# EAGLE design MOTORSHIELDV3_HETPRO_v2 (EAGLE 6.4)
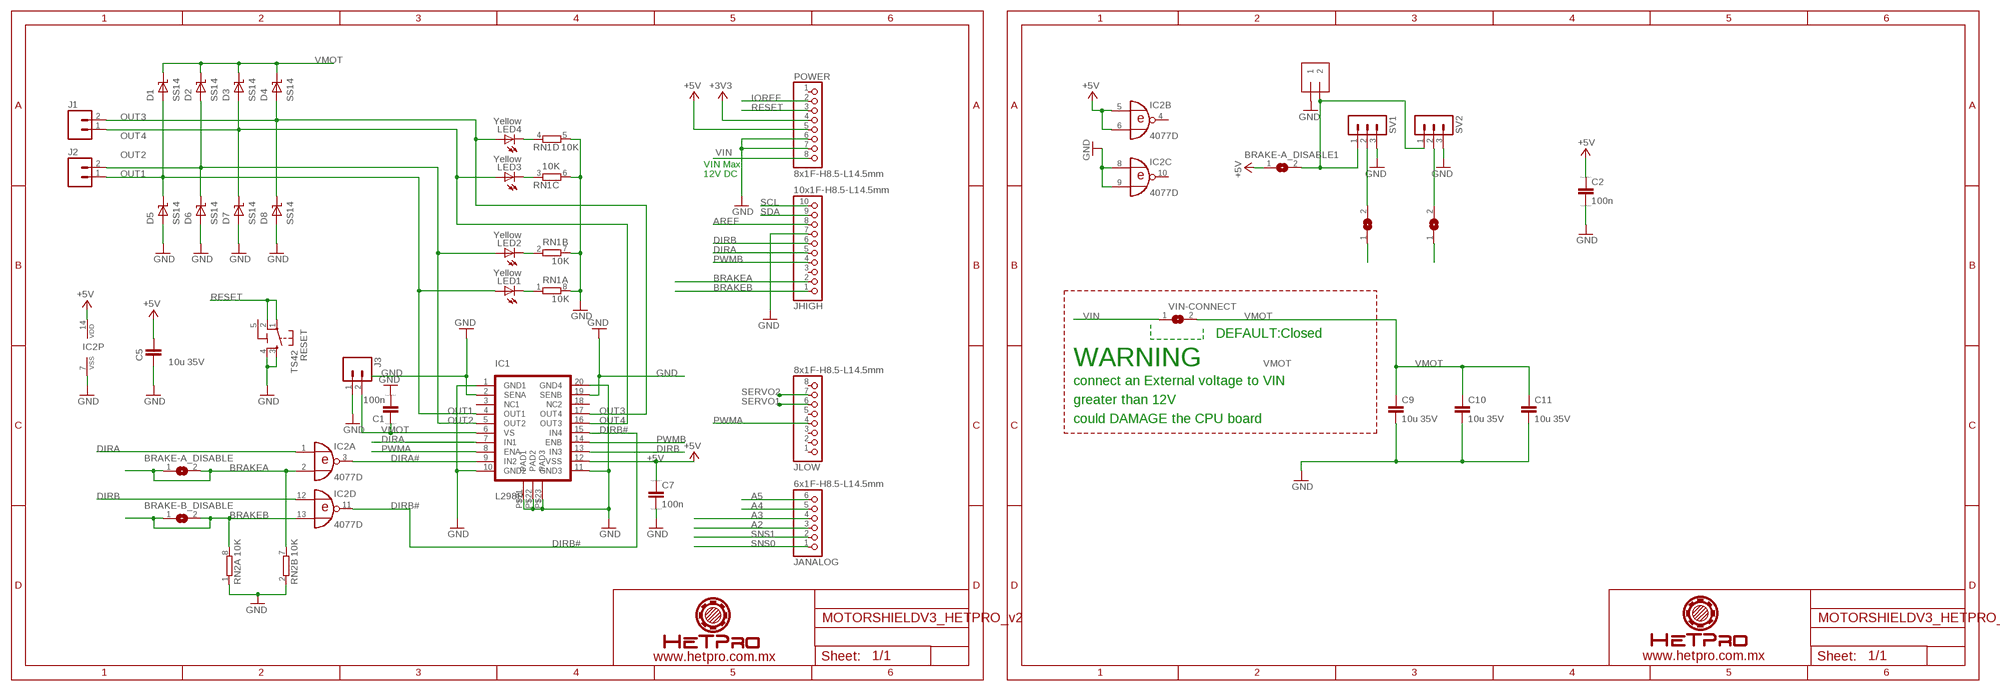
[diagram p0: schematic, sheet 1]

## Parts
BRAKE-A_DISABLE  SJ  [SJ]
BRAKE-A_DISABLE1  SJ  [SJ]
BRAKE-A_DISABLE2  SJ  [SJ]
BRAKE-A_DISABLE3  SJ  [SJ]
BRAKE-B_DISABLE  SJ  [SJ]
C1  100n  CC0603  [C0603]
C2  100n  CC0603  [C0603]
C5  10u 35V  C-EUC1210  [C1210]
C7  100n  CC0603  [C0603]
C9  10u 35V  C-EUC1210  [C1210]
C10  10u 35V  C-EUC1210  [C1210]
C11  10u 35V  C-EUC1210  [C1210]
D1  SS14  [SMA]
D2  SS14  [SMA]
D3  SS14  [SMA]
D4  SS14  [SMA]
D5  SS14  [SMA]
D6  SS14  [SMA]
D7  SS14  [SMA]
D8  SS14  [SMA]
IC1  L298P  [POWER-SO20]
IC2  4077D  [SO14]
J1  M025MM  [SCREWTERMINAL-5MM-2]
J2  M025MM  [SCREWTERMINAL-5MM-2]
J3  M025MM  [SCREWTERMINAL-5MM-2]
J4  1X2-3.5MM  [1X2-3.5MM]
JANALOG  6x1F-H8.5-L14.5mm  PINHD-1X6TH  [1X06-TH]
JHIGH  10x1F-H8.5-L14.5mm  PINHD-1X10TH  [1X10-TH]
JLOW  8x1F-H8.5-L14.5mm  PINHD-1X8TH  [1X08-TH]
LED1  Yellow  LED1206  [LED-1206]
LED2  Yellow  LED1206  [LED-1206]
LED3  Yellow  LED1206  [LED-1206]
LED4  Yellow  LED1206  [LED-1206]
POWER  8x1F-H8.5-L14.5mm  PINHD-1X8TH  [1X08-TH]
RESET  TS42  [TS42]
RN1  10K  4R-NCAY16  [CAY16]
RN2  10K  4R-NCAY16  [CAY16]
SV1  MA03-1  [MA03-1]
SV2  MA03-1  [MA03-1]
VIN-CONNECT  SJ  [SJ]

## Nets
+3V3 [power]: POWER.4
+5V [power]: BRAKE-A_DISABLE1.1 C2.1 C5.1 C7.1 IC1.P$12(VSS) IC2.5(B:I0) IC2.6(B:I1) IC2.14(P:VDD) POWER.5
A2: JANALOG.3
A3: JANALOG.4
A4: JANALOG.5
A5: JANALOG.6
AREF: JHIGH.8
BRAKEA: BRAKE-A_DISABLE.1 BRAKE-A_DISABLE.2 IC2.2(A:I1) JHIGH.2 RN2.7
BRAKEB: BRAKE-B_DISABLE.1 BRAKE-B_DISABLE.2 IC2.13(D:I1) JHIGH.1 RN2.8
DIRA: IC1.P$7(IN1) IC2.1(A:I0) JHIGH.5
DIRA#: IC1.P$9(IN2) IC2.3(A:O)
DIRB: IC1.P$13(IN3) IC2.12(D:I0) JHIGH.6
DIRB#: IC1.P$15(IN4) IC2.11(D:O)
GND [power]: C1.2 C2.2 C5.2 C7.2 C9.2 C10.2 C11.2 D5.P$2(A) D6.P$2(A) D7.P$2(A) D8.P$2(A) IC1.P$1(GND1) IC1.P$2(SENA) IC1.P$10(GND2) IC1.P$11(GND3) IC1.P$19(SENB) IC1.P$20(GND4) IC1.P$21(PAD1) IC1.P$22(PAD2) IC1.P$23(PAD3) IC2.7(P:VSS) IC2.8(C:I0) IC2.9(C:I1) J3.1 J4.1 JHIGH.7 POWER.6 POWER.7 RESET.3 RESET.4 RN1.5 RN1.6 RN1.7 RN1.8 RN2.1 RN2.2 SV1.3 SV2.3
IOREF: POWER.2
N$1: LED4.C RN1.4
N$2: LED3.C RN1.3
N$3: LED2.C RN1.2
N$4: LED1.C RN1.1
N$5: BRAKE-A_DISABLE1.2 J4.2 SV1.1 SV2.1
N$7: BRAKE-A_DISABLE2.2 SV1.2
N$8: BRAKE-A_DISABLE3.2 SV2.2
OUT1: D1.P$2(A) D5.P$1(K) IC1.P$4(OUT1) J2.1 LED1.A
OUT2: D2.P$2(A) D6.P$1(K) IC1.P$5(OUT2) J2.2 LED2.A
OUT3: D4.P$2(A) D8.P$1(K) IC1.P$17(OUT4) J1.2 LED4.A
OUT4: D3.P$2(A) D7.P$1(K) IC1.P$16(OUT3) J1.1 LED3.A
PWMA: IC1.P$8(ENA) JLOW.4
PWMB: IC1.P$14(ENB) JHIGH.4
RESET: POWER.3 RESET.1 RESET.2
SCL: JHIGH.10
SDA: JHIGH.9
SERVO1: BRAKE-A_DISABLE2.1 JLOW.6
SERVO2: BRAKE-A_DISABLE3.1 JLOW.7
SNS0: JANALOG.1
SNS1: JANALOG.2
VIN [VIN]: POWER.8 VIN-CONNECT.1
VMOT: C1.1 C9.1 C10.1 C11.1 D1.P$1(K) D2.P$1(K) D3.P$1(K) D4.P$1(K) IC1.P$6(VS) J3.2 VIN-CONNECT.2
Unconnected: IC1.P$3(NC1) IC1.P$18(NC2) IC2.4(B:O) IC2.10(C:O) JHIGH.3 JLOW.1 JLOW.2 JLOW.3 JLOW.5 JLOW.8 POWER.1 RN2.3 RN2.4 RN2.5 RN2.6

## Notes on the sheet
- VIN Max
- 12V DC
- DEFAULT:Closed
- WARNING
- connect an External voltage to VIN
- greater than 12V
- could DAMAGE the CPU board
- www.hetpro.com.mx | www.hetpro.com.mx

## Power pins joined to a net without a drawn wire
5-GND: RESET.5(5-GND)

## Library data of the parts
BRAKE-A_DISABLE BRAKE-A_DISABLE1-BRAKE-A_DISABLE3 BRAKE-B_DISABLE VIN-CONNECT = jumper:SJ: SMD solder JUMPER
C1 C2 C7 = eagle-ltspice:C: CAPACITOR, European symbol; SPICEMODEL: NONE; SPICEPREFIX: C
C5 C9-C11 = SmartPrj:C-EU: CAPACITOR, European symbol
D1-D8 = SmartPrj:SS14: DIODE SS14 Diode Schottky 1A 40v
IC1 = SmartPrj:L298P: L298P DUAL FUL-BRIDGE DRIVER PowerSO20
IC2 = 40xx:4077: Quad XNOR
J1-J3 = SparkFun:M02: Header 2 Standard 2-pin 0.1" header. Use with straight break away headers (SKU : PRT-00116), right angle break away headers (PRT-00553), swiss pins (PRT-00743), machine pins (PRT-00117), and female headers (PRT-00115). Molex polarized connector foot print use with SKU : PRT-08233 with associated crimp pins and housings.
J4 = adafruit:1X2: 3.5mm Terminal block http://www.ladyada.net/library/pcb/eaglelibrary.html
JANALOG = SmartPrj:PINHD-1X6: PIN HEADER
JHIGH = SmartPrj:PINHD-1X10: PIN HEADER
JLOW POWER = SmartPrj:PINHD-1X8: PIN HEADER
LED1-LED4 = SparkFun:LED: LEDs Standard schematic elements and footprints for 5mm, 3mm, 1206, and 0603 sized LEDs. 5mm - Spark Fun Electronics SKU : COM-00529 (and others)
RESET = SmartPrj:TS42: TS42 Dongnan Electronics Tact switch VDC 12V - 50mA
RN1 RN2 = resistor-dil:4R-N: Array Chip Resistor Source: RS Component / Phycomp
SV1 SV2 = con-lstb:MA03-1: PIN HEADER; OC_FARNELL: unknown; OC_NEWARK: unknown

## Net classes
0 default: width 0.406 mm, drill 0.61 mm, clearance 0.152 mm
1 power: width 0.406 mm, drill 0.61 mm, clearance 0.152 mm
2 VIN: width 0.406 mm, drill 0.61 mm, clearance 0.152 mm

## Board
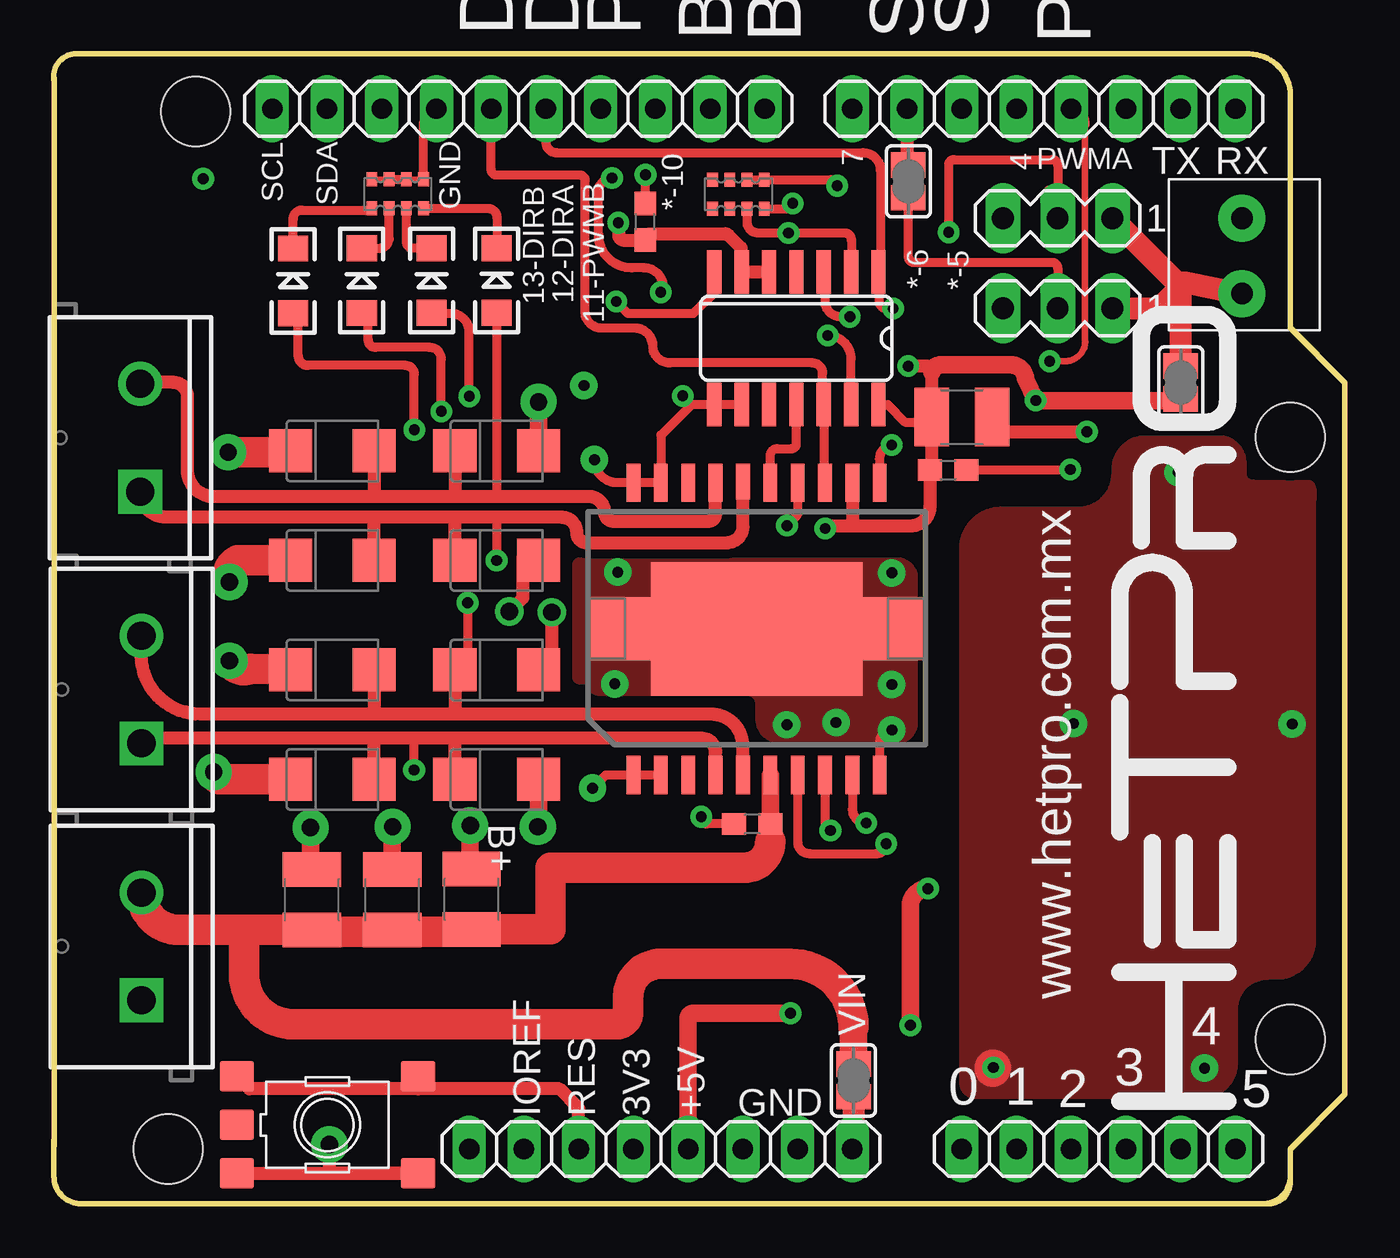
[diagram p1: board, top side]
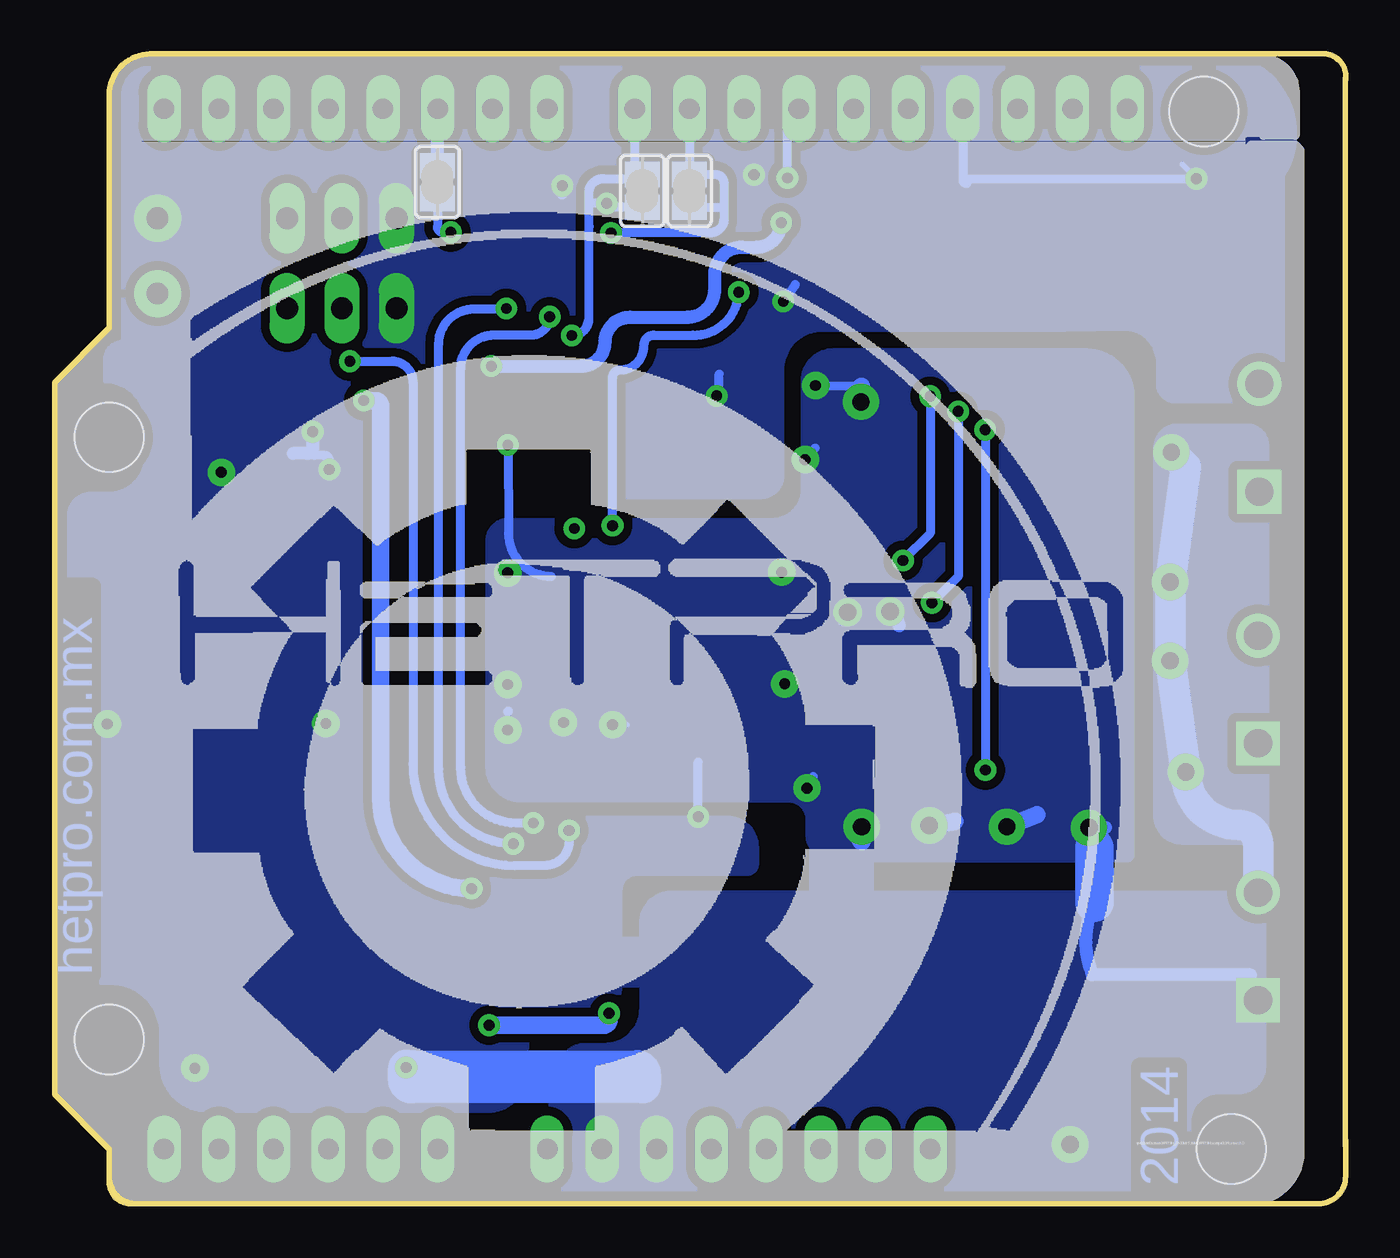
[diagram p2: board, bottom side, seen from below]

Size 59.92 x 53.35 mm. Coordinates in mm from the lower left corner, seen from the top.
Outline: 57.38,1.27 57.38,1 arc-90 56.38,0 56.11,0
Outline: 56.11,0 1.3,0
Outline: 0.01,2.69 0.01,52.22
Outline: 57.38,1.27 57.38,2.54 59.92,5.08 59.92,38.1 57.38,40.64 57.38,51.44 arc90 55.47,53.34 1.12,53.34 arc90 0,52.43 0,52.15
Outline: 57.38,1.27 arc-90 56.11,0
Outline: 0,1.25 0,1.27
Outline: 0,1.27 0,2.95
Outline: 0,1.27 arc90 1.27,0
Copper layers (1*16): Top 0.035mm / dielectric 1.5mm / Bottom 0.035mm
Design rules "default": minimum track width 8mil, minimum drill 20mil, track to track 8mil, track to pad 8mil, pad to pad 8mil, via to via 8mil, smd to smd 8mil, copper to edge 10mil, drill to drill 8mil, minimum pad ring 12mil, minimum via ring 10mil, stop-mask expansion 4mil, vias tented up to drill 25mil, thermal gap 10mil
Holes 3.2 mm at 57.38,35.56 57.38,7.62 6.58,50.67 5.31,2.54

### Footprints (pad centres in the part's own frame; a part is rotated, then mirrored left to right if it is on the bottom)
SJ = smd 1.168 x 1.6: 1 -0.762,0; 2 0.762,0
C0603 = smd 1.1 x 1: 1 -0.85,0; 2 0.85,0
C1210 = smd 1.6 x 2.7: 1 -1.4,0; 2 1.4,0
SMA = smd 2 x 2: P$1 -1.94,0; P$2 1.94,0
POWER-SO20 = smd 0.635 x 1.778: P$1 -5.715,-6.782; P$2 -4.445,-6.782; P$3 -3.175,-6.782; P$4 -1.905,-6.782; P$5 -0.635,-6.782; P$6 0.635,-6.782; P$7 1.905,-6.782; P$8 3.175,-6.782; P$9 4.445,-6.782; P$10 5.715,-6.782; P$11 5.715,6.782; P$12 4.445,6.782; P$13 3.175,6.782; P$14 1.905,6.782; P$15 0.635,6.782; P$17 -1.905,6.782; P$18 -3.175,6.782; P$19 -4.445,6.782; P$20 -5.715,6.782 | smd 0.635 x 1.651: P$16 -0.635,6.833 | smd 9.804 x 6.198: P$21 0,0 | smd 3.048 x 2.921: P$22 -6.426,0; P$23 6.426,0
SO14 = smd 0.66 x 2.032: 1 -3.81,-3.073; 2 -2.54,-3.073; 3 -1.27,-3.073; 4 0,-3.073; 5 1.27,-3.073; 6 2.54,-3.073; 7 3.81,-3.073; 8 3.81,3.073; 9 2.54,3.073; 10 1.27,3.073; 11 0,3.073; 12 -1.27,3.073; 13 -2.54,3.073; 14 -3.81,3.073
SCREWTERMINAL-5MM-2 = drill 1.3 pad 2.032 square: 1 0,0 | drill 1.3 pad 2.032: 2 5,0
1X2-3.5MM = drill 1 pad 2.184: 1 1.8,0; 2 -1.7,0
1X06-TH = drill 0.95 pad 1.422 long: 1 -6.35,0; 2 -3.81,0; 3 -1.27,0; 4 1.27,0; 5 3.81,0; 6 6.35,0
1X10-TH = drill 0.95 pad 1.422 long: 1 -11.43,0; 2 -8.89,0; 3 -6.35,0; 4 -3.81,0; 5 -1.27,0; 6 1.27,0; 7 3.81,0; 8 6.35,0; 9 8.89,0; 10 11.43,0
1X08-TH = drill 0.95 pad 1.422 long: 1 -8.89,0; 2 -6.35,0; 3 -3.81,0; 4 -1.27,0; 5 1.27,0; 6 3.81,0; 7 6.35,0; 8 8.89,0
LED-1206 = smd 1.2 x 1.4: A -1.5,0; C 1.5,0
TS42 = smd 1.6 x 1.4: 1 -4.2,2.25; 2 4.2,2.25; 3 -4.2,-2.25; 4 4.2,-2.25; 5 -4.2,0
CAY16 = smd 0.5 x 0.65: 1 -1.2,-0.675; 2 -0.4,-0.675; 3 0.4,-0.675; 4 1.2,-0.675; 5 1.2,0.675; 6 0.4,0.675; 7 -0.4,0.675; 8 -1.2,0.675
MA03-1 = drill 1.016 long: 1 -2.54,0; 2 0,0; 3 2.54,0

### Placement (x,y rotation side)
BRAKE-A_DISABLE  30.45,46.99 270 bottom
BRAKE-A_DISABLE1  52.3,38.1 90 top
BRAKE-A_DISABLE2  42.15,47.4 270 bottom
BRAKE-A_DISABLE3  39.66,47.43 270 top
BRAKE-B_DISABLE  32.64,46.99 90 bottom
C1  32.41,17.62 180 top
C2  41.5,34.04 0 top
C5  42.14,36.5 0 top
C7  27.45,45.55 90 top
C9  19.39,14.12 90 top
C10  11.97,14.11 90 top
C11  15.71,14.11 90 top
D1  12.93,19.68 0 top
D2  12.93,24.77 0 top
D3  12.93,29.84 0 top
D4  12.93,34.92 0 top
D5  20.55,19.68 0 top
D6  20.55,24.77 0 top
D7  20.55,29.84 0 top
D8  20.55,34.92 0 top
IC1  32.61,26.67 0 top
IC2  34.46,40.15 180 top
J1  4.01,33.04 90 top
J2  4.06,21.36 90 top
J3  4.06,9.44 90 top
J4  55.14,43.92 90 top
JANALOG  48.49,2.54 0 top
JHIGH  21.56,50.8 180 top
JLOW  45.95,50.8 180 top
LED1  11.1,42.82 90 top
LED2  14.29,42.82 90 top
LED3  17.53,42.83 90 top
LED4  20.55,42.83 90 top
POWER  28.17,2.54 0 top
RESET  12.7,3.66 0 top
RN1  15.96,46.85 0 top
RN2  31.77,46.83 180 top
SV1  46.58,45.72 180 top
SV2  46.58,41.55 180 top
VIN-CONNECT  37.11,5.72 90 top

### Tracks (layer width: path | path; a pad name or v marks a point on that pad's centre or on a via)
+5V  (via drill 0.5)
  Top 0.406: IC2.6 IC2.5 | IC2.14 38.7,37.08 39.51,36.27 40.51,36.27 C5.1
  Top 0.61: 36.89,31.44 39.75,31.44 arc90 40.65,32.34 C2.1 40.74,34.12 C5.1 40.74,38.57 40.74,38.61 arc90 40.48,38.86 v39.65,38.86 | 36.89,31.44 35.91,31.44 arc90 v35.8,31.33 | IC1.P$12 37.06,31.61 arc-90 36.89,31.44 | 32,43.14 arc90 IC2.6 | v26.2,45.51 arc-45 26.21,45.52 26.21,44.96 arc90 26.46,44.7 C7.1 27.45,44.75 arc-90 27.7,45 31.13,45 arc-45 31.31,44.93 31.87,44.37 arc-45 31.91,44.28 31.91,43.48 arc90 32.16,43.22 IC2.5
  Top 0.813: POWER.5 29.44,8.59 arc-90 29.68,8.83 arc-90 29.69,8.84 v34.19,8.84 | v39.75,8.28 39.75,13.8 arc-90 v40.57,14.62 | 40.74,38.57 arc-90 41.05,38.88 arc-45 41.15,38.92 44.41,38.92 arc-90 45.1,38.23 v45.57,37.26 52.12,37.26 arc45 BRAKE-A_DISABLE1.1
  Bottom 0.61: v39.65,38.86 35.48,38.86 arc-90 34.37,39.97 arc90 33.21,41.13 30.56,41.13 arc-90 29.28,42.41 29.28,43.11 arc90 28.01,44.38 27.33,44.38 arc-90 v26.2,45.51
  Bottom 0.813: v34.19,8.84 34.19,8.53 arc90 34.44,8.28 v39.75,8.28 | v40.57,14.62 arc90 44.79,18.84 44.79,37.01 arc-90 45.04,37.26 v45.57,37.26
BRAKEA  (via drill 0.5)
  Top 0.406: IC2.2 arc90 37.01,43.23 37.01,44.72 arc90 36.69,45.04 v34.09,45.04 32.68,45.04 arc-90 32.17,45.55 RN2.7
  Bottom 0.406: JHIGH.2 BRAKE-A_DISABLE.1 29.25,47.75 arc90 28.85,47.35 28.85,46.23 | 28.85,46.23 28.85,45.69 arc90 29.5,45.04 v34.09,45.04 | BRAKE-A_DISABLE.2 28.85,46.23 arc-90 28.85,46.23
BRAKEB  (via drill 0.5)
  Top 0.406: IC2.13 37,39.19 arc90 v35.91,40.28 | 33.04,46.23 arc90 32.99,46.18 arc90 RN2.8 34.04,46.16 arc90 v34.29,46.41
  Bottom 0.406: JHIGH.1 32.99,47.88 arc-90 BRAKE-B_DISABLE.2 arc90 33.06,47.56 34.46,47.56 arc-90 35.12,46.9 35.12,46.42 | v35.91,40.28 arc-90 35.12,41.07 35.12,45.34 | 35.12,45.34 35.12,46.42 | 35.11,45.33 arc90 35.12,45.34 | v34.29,46.41 arc-90 34.3,46.23 | BRAKE-B_DISABLE.1 34.11,46.23 arc90 v34.29,46.41 | v34.29,46.41 35.11,46.41 arc90 35.12,46.42
DIRA  (via drill 0.5)
  Top 0.406: IC1.P$7 34.52,16.79 arc90 35.07,16.24 38.17,16.24 arc90 v38.63,16.7 | v38.95,41.53 38.64,41.53 arc-90 38.31,41.86 38.31,43.18 arc90 IC2.1 arc90 38.36,43.31 38.36,47.96 arc90 37.56,48.76 23.33,48.76 arc-90 22.83,49.25 JHIGH.5
  Bottom 0.406: v38.63,16.7 arc90 42.09,20.16 42.09,39.88 arc90 40.46,41.51 38.97,41.51 arc-90 v38.95,41.53
DIRA#  (via drill 0.5)
  Top 0.406: IC1.P$9 37.06,18.3 arc90 v37.7,17.66 | v36.94,41.15 36.51,41.15 arc-90 35.8,41.86 arc6 IC2.3
  Bottom 0.406: v37.7,17.66 38.5,17.66 arc90 41.07,20.23 41.07,38.74 arc90 39.5,40.31 37.78,40.31 arc-90 v36.94,41.15
DIRB
  Top 0.406: IC1.P$13 35.73,33.51 IC2.12 35.68,37.13 35.68,38.53 arc90 35.2,39.01 28.58,39.01 arc-90 27.8,39.79 arc90 26.97,40.62 25.43,40.62 arc-90 24.65,41.4 24.65,46.31 arc-45 24.66,46.33 24.66,47.47 arc90 24.4,47.72 20.55,47.72 arc-90 20.29,47.97 JHIGH.6
DIRB#
  Top 0.406: IC1.P$15 33.25,34.71 arc-90 33.57,35.03 34.24,35.03 arc90 34.45,35.24 34.46,35.24 IC2.11
GND  (via drill 0.5, 0.5 pad 1.27, 0.8, 0.8 pad 1.68)
  Top 0.254: IC1.P$22 26.89,26.67 | RN1.5 RN1.6 | RN1.7 RN1.8
  Top 0.406: IC2.9 IC2.8 29.59,37.08 | 29.59,37.08 v29.19,37.48 | RN2.1 RN2.2 36.08,47.51 arc-90 v36.36,47.23 | v25,19.28 25.61,19.89 IC1.P$1 IC1.P$2 | v25.09,34.52 arc90 26.16,33.45 IC1.P$20 28.13,33.45 arc90 28.15,33.47 arc90 IC1.P$19 28.17,35.65 29.59,37.08 | IC1.P$10 38.33,21.42 arc-90 v38.89,21.98 | IC1.P$11 38.33,34.46 arc-90 v38.88,35.2 | C1.2 30.3,17.62 arc-90 30.05,17.87 v30.05,17.95 | C2.2 arc-90 42.38,34.06 v47.17,34.06 | C7.2 27.45,47.64 arc-90 v27.46,47.74 | IC2.7 30.65,42.27 29.67,41.3 26.65,41.3 v26.1,41.85 | RN1.7 RN1.6 | RN1.5 17.16,50.21 JHIGH.7
  Top 0.61: v21.14,27.48 21.77,28.11 21.77,29.97 21.89,29.84 D7.P$2 | D6.P$2 23.11,25.39 v23.11,27.44 | RESET.3 RESET.4 12.79,1.41 v12.79,2.75 | C5.2 43.54,36.07 arc90 43.79,35.82 v47.94,35.82
  Top 0.813: C11.2 15.7,17.13 arc-90 v15.72,17.5 | D8.P$2 22.49,36.85 arc90 v22.49,37.2 | D5.P$2 22.49,17.75 arc90 v22.46,17.49 | C9.2 19.32,15.59 v19.32,17.55 | C10.2 11.91,15.57 v11.91,17.45
  Top 1.676: v43.6,6.32 arc90 43.57,6.29 43.57,6.26
  Bottom 0.254: 33.35,22.23 34.07,22.23 34.07,21.96 | v6.93,47.55 7.59,48.23
  Bottom 0.406: v29.19,37.48 29.08,37.59 29.08,38.49 | v36.36,47.23 36.36,46.8 arc90 36.37,46.79 | v25,19.28 25,19.54 24.72,19.82 | v25.09,34.52 25.09,34.59 24.62,35.06 | v24.6,37.96 22.51,37.96 arc90 22.48,37.93 | 38.89,22.81 arc90 38.85,22.85 | v38.88,35.2 38.85,31.1 arc-90 36.86,29.11 | v30.05,17.95 30.05,20.49 | JHIGH.7 17.75,47.5 arc-90 17.6,47.34 arc90 17.39,47.55 v6.93,47.55 | v47.17,34.06 47.17,34.47 arc-90 47.42,34.72 47.86,34.72 | v27.46,47.74 27.47,47.94 arc90 27.46,47.95 | v26.1,41.85 25.54,42.64
  Bottom 0.61: v21.14,27.48 20.88,27.3 20.71,26.8 | v23.11,27.44 23.29,27.09 23.29,27.66 | v47.94,35.82 47.94,35.06 arc90 48.19,34.81 48.84,34.81 | 4.42,10.62 11.76,10.62 arc45 11.66,13.97 | 11.32,17.52 arc-45 11.15,17.45 v11.91,17.45 11.58,16.71 arc-45 11.66,16.54
  Bottom 0.813: v15.72,17.5 14.32,18.04 | v19.32,17.55 18.15,17.73 arc90 18.13,17.75 | v22.49,37.2 22.48,37.93 | v22.46,17.49 22.46,16.8 arc90 22.51,17.1
  Bottom 1.676: 43.28,6.29 32.87,6.29 arc90 32.62,6.04 32.62,5.49 43.34,5.49 arc90 43.6,5.74 v43.6,6.32
  Bottom 1.778: 11.66,13.97 11.66,16.54
  other vias: 38.89,24.09 38.89,29.27 26.17,29.3 26.03,24.12 34.02,22.22 36.3,22.33 52.18,33.93 47.33,22.28 57.47,22.26 53.4,6.29
  pour Bottom (isolate 0.406, no thermals): 3.81,12.5 3.81,6.38 arc90 4.99,5.2 5.89,5.2 arc-90 7.29,3.8 7.29,1.88 arc90 8.47,0.7 38.28,0.7 arc90 39.78,2.2 39.78,2.52 arc90 38.39,3.91 arc-90 36.46,5.84 36.46,6.16 arc90 35.28,7.34 34.38,7.34 arc-90 32.66,9.06 32.66,13.02 arc90 31.27,14.41 4.44,14.41 arc90 3.77,13.96 3.79,13.37
  pour Bottom (isolate 0.406, no thermals): 10.19,15.98 23.79,15.98 arc90 24.92,17.11 24.92,17.8 arc-90 25.89,18.77 38.31,18.77 arc90 39.77,20.23 39.77,30.78 arc90 38.88,31.67 26.6,31.67 arc-90 25.14,33.13 25.14,38.18 arc90 23.78,39.54 12.03,39.54 arc90 9.94,37.45 9.94,16.21 arc90 10.17,15.98
  pour Bottom (isolate 0.406, no thermals): 13.06,40.58 24.29,40.58 arc-90 26.18,38.69 26.18,33.78 arc90 27.15,32.81 36.19,32.81 arc90 37.42,34.04 37.42,35.42 arc-90 38.08,36.08 39.4,36.08 arc-90 40.17,35.31 40.96,34.51 arc-45 41.04,34.33 41.04,30.71 41.47,30.27 arc-45 41.55,30.09 41.55,24.68 40.65,23.78 arc45 40.58,23.6 40.58,19.42 arc-90 39.05,17.89 28.73,17.89 arc90 27.35,16.51 27.35,15.79 arc90 27.81,15.33 32.92,15.33 arc-90 33.69,14.56 33.69,10.11 arc90 35.27,8.53 36.6,8.53 arc-90 38.03,7.1 38.03,6.13 arc90 39.82,4.34 52.79,4.34 arc90 54.94,6.49 54.94,7.92 arc-90 57.29,10.27 57.59,10.27 arc90 59.23,11.91 59.23,31.89 arc90 58.21,32.91 57.39,32.91 arc-90 55.65,34.65 55.65,36.29 arc-90 57.54,38.18 57.54,39.14 arc90 56.72,39.96 56.72,47.94 arc90 56.39,52.75 4.09,52.75 arc90 2.94,47.68 2.94,38.44 arc90 4.13,37.25 7.88,37.25 arc90 8.68,38.05 8.68,38.85 arc-90 10.12,40.62
  pour Top (isolate 0.406, no thermals): 24.43,29.86 39.13,29.86 arc-90 39.97,29.02 39.97,22.33 arc-90 39.09,21.45 33.76,21.45 arc-90 32.68,22.53 32.68,23.2 arc90 32.19,23.69 25.32,23.69 arc-90 24.79,24.22 24.43,24.22 arc-90 24.18,24.47 24.18,29.61 arc-90
  pour Top (isolate 0.406, no thermals): 58.36,32.74 58.36,12.23 arc-90 56.72,10.59 56.31,10.59 arc90 54.73,9.01 54.73,6.52 arc-90 53.27,5.06 42.8,5.06 arc-90 42.23,5.63 42.23,30.4 arc-90 43.97,32.14 47.55,32.14 arc90 49.3,33.89 49.3,34.07 arc-90 50.68,35.45 54.06,35.45 arc-90 55.13,34.38 55.13,33.9 arc90 55.65,33.38 58.18,33.38 arc-90 58.35,33.21 arc-90 58.37,33.19 58.37,32.62
GND1
  pour Bottom (isolate 0.406, no thermals): 22.03,16.09 22.03,12.76 arc90 22.88,11.91 24.31,11.91 arc90 24.77,12.37 24.77,16.34 arc90 24.19,16.92 22.85,16.92 arc90 22.02,16.09
GND2
  pour Bottom (isolate 0.406, no thermals): 10.78,12.03 11.64,12.07 arc90 12.04,13.2
GND3
  pour Bottom (isolate 0.406, no thermals): 31.53,10.17 34.86,10.17 arc90 35.71,11.02 35.67,11.88 arc90 34.54,12.28 31.4,12.3 arc90 30.82,11.72 30.7,10.99 arc90 31.53,10.16
N$1
  Top 0.406: RN1.4 20.16,46.17 arc-90 20.56,45.77 20.56,44.35 arc-90 LED4.C
N$2
  Top 0.406: LED3.C 16.64,44.33 arc-90 16.37,44.59 16.37,46.16 arc90 RN1.3
N$3
  Top 0.406: LED2.C 15.1,44.32 arc90 15.53,44.76 15.56,44.76 RN1.2
N$4
  Top 0.406: LED1.C 11.1,45.7 arc-90 11.51,46.1 14.69,46.1 arc90 RN1.1
N$5
  Top 1.016: SV1.1 52.02,42.82 arc45 52.2,42.75 52.26,42.75 | 52.26,42.75 52.51,42.75 | 52.51,42.75 J4.2 | SV2.1 51.2,41.55 arc45 51.38,41.62 52.51,42.75 | BRAKE-A_DISABLE1.2 52.3,42.65 arc45 52.26,42.75
N$7  (via drill 0.5)
  Top 0.406: 46.17,47.03 46.17,46.24 arc45 46.24,46.06 SV1.2 46.58,48.19 arc90 46.33,48.44 41.78,48.44 arc90 41.53,48.19 v41.53,45.07
  Bottom 0.406: BRAKE-A_DISABLE2.2 42.15,45.32 arc-90 41.89,45.07 v41.53,45.07
N$8
  Top 0.406: SV2.2 46.58,43.42 arc90 46.33,43.67 39.91,43.67 arc-90 39.66,43.92 BRAKE-A_DISABLE3.2
OUT1  (via drill 0.5)
  Top 0.406: v16.72,20.12 16.72,21.56 16.75,21.59 | v16.73,35.91 16.73,38.48 arc90 16.32,38.89 11.79,38.89 arc-90 11.34,39.34 11.34,41.08 arc90 LED1.A
  Top 0.61: 18.64,21.59 30.07,21.59 arc-90 30.71,20.95 IC1.P$4 | 18.64,21.59 16.75,21.59 14.83,21.59 | D1.P$2 14.87,21.55 14.83,21.59 | D5.P$1 18.61,21.55 18.64,21.59 | 14.83,21.59 4.3,21.59 arc90 J2.1
  Bottom 0.406: v16.73,35.91 v16.73,20.13 v16.72,20.12
OUT2  (via drill 0.5)
  Top 0.406: v19.2,27.88 19.2,25.36 D6.P$1 | v17.98,36.76 17.98,39.19 arc90 17.43,39.73 14.92,39.73 arc-90 14.58,40.07 14.58,41.03 LED2.A
  Top 0.61: IC1.P$5 31.98,21.24 arc90 30.51,22.71 18.61,22.71 | 18.61,22.71 14.71,22.71 | 14.71,22.71 6.8,22.71 arc-90 4.06,25.45 J2.2 | D2.P$2 14.87,22.87 14.71,22.71 | D6.P$1 18.61,22.71
  Bottom 0.406: v17.98,36.76 17.98,29.1 v19.2,27.88
OUT3
  Top 0.406: LED4.A 20.55,32.81
  Top 0.61: 18.53,32.81 14.73,32.81 14.87,32.95 D4.P$2 14.87,32.8 7.43,32.8 arc-90 6.2,34.03 6.2,37.44 arc90 5.53,38.11 4.08,38.11 arc90 J1.2 | 18.53,32.81 18.69,32.81 | IC1.P$17 30.71,32 arc-90 30.37,31.66 25.98,31.66 arc-90 25.56,32.08 arc90 24.82,32.81 20.55,32.81 18.69,32.81 | D8.P$1 18.61,32.9 | 18.61,32.9 18.53,32.81 | 18.61,32.9 18.69,32.81
OUT4  (via drill 0.5)
  Top 0.406: 18.61,31.83 20.55,31.83 v20.55,29.84 | v19.28,37.47 19.28,40.46 arc90 18.44,41.3 17.57,41.3 arc-90 LED3.A
  Top 0.61: IC1.P$16 31.98,31.43 arc-90 31.21,30.66 24.74,30.66 arc-90 24.27,31.13 arc90 23.54,31.86 18.58,31.86 | 18.58,31.86 14.83,31.86 | D3.P$2 14.87,31.82 arc90 14.83,31.86 | D7.P$1 18.61,31.83 arc90 18.58,31.86 | 14.83,31.86 5.18,31.86 arc-90 J1.1
  Bottom 0.406: v19.28,37.47 19.28,31.11 v20.55,29.84
PWMA  (via drill 0.5)
  Top 0.305: v46.21,39.09 47.01,39.09 arc90 47.86,40.08 47.86,50.06
  Top 0.406: IC1.P$8 35.79,17.57 arc90 v36.04,17.32 | 47.85,50.06 arc45 47.77,50.24 47.32,50.7 arc90 JLOW.4 arc-90 47.86,50.06
  Bottom 0.406: v36.04,17.32 36.04,16.82 arc90 37.17,15.69 38.57,15.69 arc90 43.29,20.41 43.29,38.13 arc-90 44.25,39.09 v46.21,39.09
PWMB  (via drill 0.5)
  Top 0.406: IC1.P$14 34.52,32.06 arc-45 34.44,31.89 v34.02,31.46 | v28.17,42.29 28.29,42.51 arc90 27.38,43.42 26.82,43.42 arc-90 25.28,44.96 25.28,46.96 arc-90 v25.91,47.59
  Bottom 0.406: v34.02,31.46 34.02,38.34 arc90 33.68,38.68 arc-90 32.57,39.79 32.57,39.83 arc90 32.1,40.3 30.29,40.3 arc-90 v28.17,42.29 | 25.8,50.38 arc90 JHIGH.4 arc-90 25.91,50.27 v25.91,47.59
RESET
  Top 0.61: POWER.3 24.36,4.43 23.46,5.33 16.92,5.33 | 16.92,5.33 9.08,5.33 RESET.1 | RESET.2 16.9,5.35 16.92,5.33
SERVO1
  Bottom 0.61: BRAKE-A_DISABLE2.1 JLOW.6 arc90 JLOW.6
SERVO2
  Top 0.61: JLOW.7 39.6,48.72 arc-90 BRAKE-A_DISABLE3.1
VIN
  Top 1.016: VIN-CONNECT.1 37.11,2.59 arc-90 POWER.8
VMOT  (via drill 0.8 pad 1.68)
  Top 0.254: C10.1 10.82,12.71 arc90 11.01,12.9 | 33.25,17.64 arc45 C1.1
  Top 0.406: 33.25,16.81 33.26,16.82 C1.1
  Top 0.813: IC1.P$6 33.25,16.81
  Top 1.27: VIN-CONNECT.2 37.11,8.18
  Top 1.422: v8.09,34.86 10.92,34.86 D4.P$1 | D3.P$1 8.53,29.84 arc90 v8.14,28.85 | D2.P$1 9.13,24.82 arc-90 v8.14,25.19 | D1.P$1 7.76,19.68 arc-90 v7.42,20.03 | 33.25,16.81 arc-90 32.02,15.58 23.06,15.58 23.06,12.74 20.45,12.74 | 37.11,8.18 arc90 34.16,11.13 28.17,11.13 arc90 26.65,9.61 26.65,8.88 arc-90 26.1,8.33 11.12,8.33 arc-90 8.83,10.62 8.83,12.54 arc90 8.66,12.71 | J3.2 arc90 5.79,12.71 8.66,12.71 | 8.66,12.71 C10.1 arc90 12.05,12.63 16.21,12.63 | 16.21,12.63 arc90 16.12,12.71 C11.1 | C9.1 arc-90 19.41,12.74 20.45,12.74 | 20.45,12.74 arc-90 20.34,12.63 16.21,12.63
  Bottom 1.422: v8.09,34.86 7.42,34.19 v8.14,28.85 v8.14,25.19 v7.42,20.03 arc-90 4.96,17.57 arc90 4.06,16.68 J3.2
  pour Bottom (isolate 0.406, no thermals): 4.13,16.78 7.56,16.78 arc90 8.81,18.03 8.81,35.05 arc90 7.78,36.08 4.59,36.08 arc90 3.67,35.16 3.67,17.24 arc90

### Text on the board
Bottom: hetpro.com.mx | 2014
tPlace: B+
tNames: SCL | SDA | GND | *-10 | 7 | 4 | PWMA | TX | RX | 13-DIRB | 12-DIRA | 11-PWMB | *-6 | *-5 | www.hetpro.com.mx | VIN | 4 | 0 | 1 | 3 | IOREF | RES | 3V3 | +5V | GND | 2 | 5
bNames: C:/Users/PC/Dropbox/HETPRO/MULTIMEDIA_HETPRO/motorShield.bmp
_tNames: DIRB-13 | DIRA-12 | PWMB-11 | BREAKA-9 | BREAKB-8 | SERVO1-6 | SERVO2-5 | PWMA-3 | OUT3 | MOTOR B | OUT4 | OUT2 | MOTORA | OUT1 | Voltaje de Entrada | + | (7 a 46)VDC | -